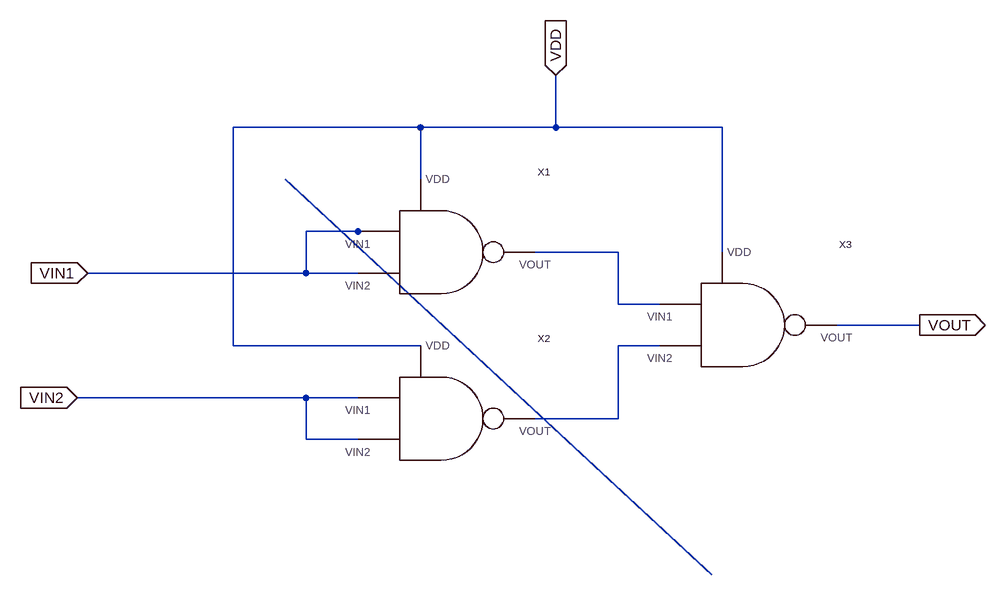
[diagram p0: schematic ORbyNAND.asc]
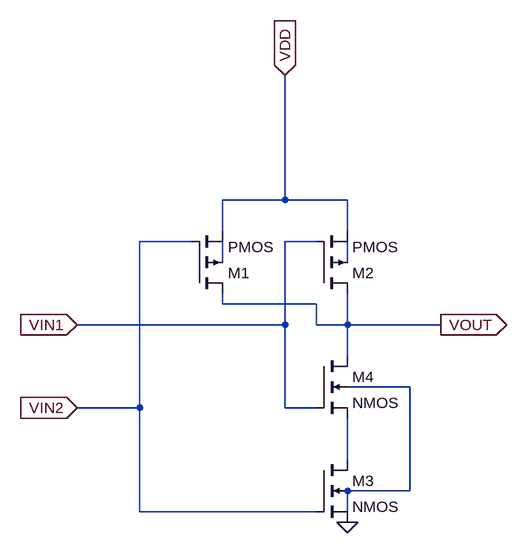
[diagram p1: sub-circuit nand.asc]
ORbyNAND.asc, the LTspice schematic file:
Version 4
SHEET 1 1100 680
WIRE 208 -80 -80 -80
WIRE 416 -80 416 -160
WIRE 416 -80 208 -80
WIRE 672 -80 416 -80
WIRE 208 0 208 -80
WIRE 112 80 32 80
WIRE 128 80 112 80
WIRE 512 112 384 112
WIRE 672 112 672 -80
WIRE 32 144 32 80
WIRE 32 144 -304 144
WIRE 112 144 32 144
WIRE 512 192 512 112
WIRE 576 192 512 192
WIRE 976 224 848 224
WIRE -80 256 -80 -80
WIRE 208 256 -80 256
WIRE 576 256 512 256
WIRE 32 336 -320 336
WIRE 112 336 32 336
WIRE 512 368 512 256
WIRE 512 368 384 368
WIRE 32 400 32 336
WIRE 112 400 32 400
WIRE 656 608 0 0
FLAG -304 144 VIN1
IOPIN -304 144 In
FLAG -320 336 VIN2
IOPIN -320 336 In
FLAG 416 -160 VDD
IOPIN 416 -160 In
FLAG 976 224 VOUT
IOPIN 976 224 Out
SYMBOL NAND 224 112 R0
SYMATTR InstName X1
SYMBOL NAND 224 368 R0
SYMATTR InstName X2
SYMBOL NAND 688 224 R0
SYMATTR InstName X3

nand.asc, the sub-circuit schematic file:
Version 4
SHEET 1 880 680
WIRE 32 -64 32 -256
WIRE 32 -64 -64 -64
WIRE 128 -64 32 -64
WIRE -64 -16 -64 -64
WIRE 128 -16 128 -64
WIRE -112 0 -192 0
WIRE 80 0 32 0
WIRE -64 32 -64 0
WIRE 128 32 128 0
WIRE -64 96 -64 80
WIRE 80 96 -64 96
WIRE 32 128 32 0
WIRE 32 128 -288 128
WIRE 80 128 80 96
WIRE 128 128 128 80
WIRE 128 128 80 128
WIRE 272 128 128 128
WIRE 128 176 128 128
WIRE 224 224 128 224
WIRE -192 256 -192 0
WIRE -192 256 -288 256
WIRE 32 256 32 128
WIRE 80 256 32 256
WIRE 128 336 128 272
WIRE 224 384 224 224
WIRE 224 384 128 384
WIRE -192 416 -192 256
WIRE 80 416 -192 416
WIRE 128 416 128 384
FLAG 128 432 0
FLAG -288 128 VIN1
IOPIN -288 128 In
FLAG -288 256 VIN2
IOPIN -288 256 In
FLAG 32 -256 VDD
IOPIN 32 -256 In
FLAG 272 128 VOUT
IOPIN 272 128 Out
SYMBOL pmos4 -112 80 M180
SYMATTR InstName M1
SYMATTR Value2 l=90n w=400n
SYMBOL pmos4 80 80 M180
SYMATTR InstName M2
SYMATTR Value2 l=90n w=400n
SYMBOL nmos4 80 336 R0
SYMATTR InstName M3
SYMATTR Value2 l=90n w=200n
SYMBOL nmos4 80 176 R0
SYMATTR InstName M4
SYMATTR Value2 l=90n w=200n

The netlist it stands for:
* ORbyNAND.asc
XX1 VDD VIN1 N001 VIN1 nand
XX2 VDD VIN2 N002 VIN2 nand
XX3 VDD N001 VOUT N002 nand

* block symbol definitions
.subckt nand VDD VIN1 VOUT VIN2
M1 VOUT VIN2 VDD N001 PMOS l=90n w=400n
M2 VOUT VIN1 VDD N002 PMOS l=90n w=400n
M3 N004 VIN2 0 N003 NMOS l=90n w=200n
M4 VOUT VIN1 N004 N003 NMOS l=90n w=200n
.ends nand

.model NMOS NMOS
.model PMOS PMOS
.lib standard.mos
.backanno
.end